# EAGLE design monolithich (EAGLE 6.3)
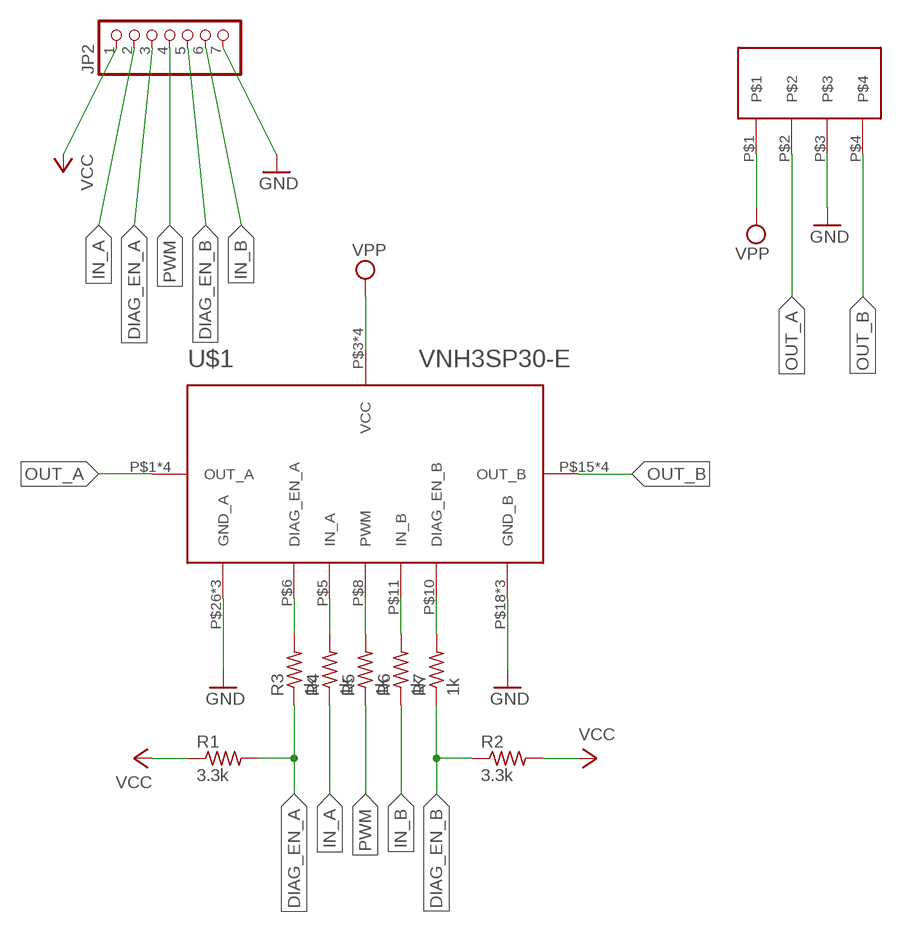
[diagram p0: schematic, sheet 1]

## Parts
JP2  PINHD-1X7  [1X07]
R1  3.3k  R-US_R1206  [R1206]
R2  3.3k  R-US_R1206  [R1206]
R3  1k  R-US_R1206  [R1206]
R4  1k  R-US_R1206  [R1206]
R5  1k  R-US_R1206  [R1206]
R6  1k  R-US_R1206  [R1206]
R7  1k  R-US_R1206  [R1206]
U$1  VNH3SP30-E  [MULTIPOWER-SO-30]
U$2  PINHEAD-5MM-1X4  [5MM-HEADER-4]

## Nets
DIAG_EN_A: JP2.3 R1.2 R3.1
DIAG_EN_B: JP2.5 R2.1 R7.1
GND: JP2.7 U$1.P$18(GND_B) U$1.P$19(GND_B) U$1.P$20(GND_B) U$1.P$26(GND_A) U$1.P$27(GND_A) U$1.P$28(GND_A) U$2.P$3
IN_A: JP2.2 R4.1
IN_B: JP2.6 R6.1
N$1: R3.2 U$1.P$6(DIAG_EN_A)
N$2: R4.2 U$1.P$5(IN_A)
N$3: R5.2 U$1.P$8(PWM)
N$4: R6.2 U$1.P$11(IN_B)
N$5: R7.2 U$1.P$10(DIAG_EN_B)
OUT_A: U$1.P$1(OUT_A) U$1.P$25(OUT_A) U$1.P$30(OUT_A) U$1.T$1(OUT_A) U$2.P$2
OUT_B: U$1.P$15(OUT_B) U$1.P$16(OUT_B) U$1.P$21(OUT_B) U$1.T$2(OUT_B) U$2.P$4
PWM: JP2.4 R5.1
VCC: JP2.1 R1.1 R2.2
VPP: U$1.P$3(VCC) U$1.P$13(VCC) U$1.P$23(VCC) U$1.T$3(VCC) U$2.P$1

## Library data of the parts
JP2 = pinhead:PINHD-1X7: PIN HEADER
R1-R7 = rcl:R-US_: RESISTOR, American symbol
U$1 = controller:VNH3SP30
U$2 = controller:PINHEAD-5MM-1X4

## Board
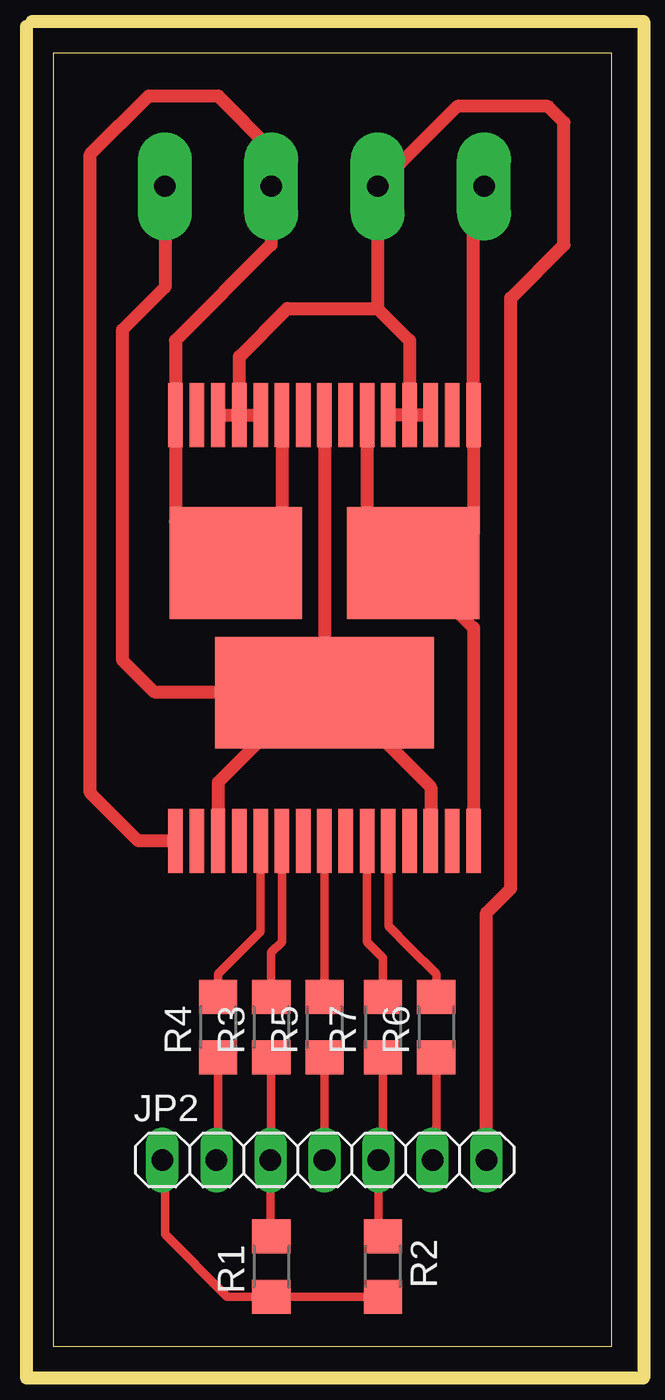
[diagram p1: board, top side]

Size 26.25 x 60.75 mm. Coordinates in mm from the lower left corner, seen from the top.
Outline: 0,0 26.25,0 26.25,60.75 0,60.75 0,0
Copper layers (1*16): Top 0.035mm / dielectric 1.5mm / Bottom 0.035mm
Design rules "default": minimum track width 10mil, minimum drill 24mil, track to track 8mil, track to pad 8mil, pad to pad 8mil, via to via 8mil, smd to smd 8mil, copper to edge 40mil, drill to drill 8mil, minimum pad ring 10mil, minimum via ring 8mil, stop-mask expansion 4mil, vias tented up to drill 0mil, thermal gap 10mil
Milling: 4 lines

### Footprints (pad centres in the part's own frame; a part is rotated, then mirrored left to right if it is on the bottom)
1X07 = drill 1.016 long: 1 -7.62,0; 2 -5.08,0; 3 -2.54,0; 4 0,0; 5 2.54,0; 6 5.08,0; 7 7.62,0
R1206 = smd 1.6 x 1.803: 1 -1.422,0; 2 1.422,0
MULTIPOWER-SO-30 = smd 0.68 x 3: P$1 -7,-10; P$2 -6,-10; P$3 -5,-10; P$4 -4,-10; P$5 -3,-10; P$6 -2,-10; P$7 -1,-10; P$8 0,-10; P$9 1,-10; P$10 2,-10; P$11 3,-10; P$12 4,-10; P$13 5,-10; P$14 6,-10; P$15 7,-10; P$16 7,10; P$17 6,10; P$18 5,10; P$19 4,10; P$20 3,10; P$21 2,10; P$22 1,10; P$23 0,10; P$24 -1,10; P$25 -2,10; P$26 -3,10; P$27 -4,10; P$28 -5,10; P$29 -6,10; P$30 -7,10 | smd 6.23 x 5.25: T$1 -4.165,3.05; T$2 4.165,3.05 | smd 10.3 x 5.25: T$3 0,-3.05
5MM-HEADER-4 = drill 1 pad 2.54 long: P$1 -7.5,0; P$2 -2.5,0; P$3 2.5,0; P$4 7.5,0

### Placement (x,y rotation side)
JP2  12.75,8.75 0 top
R1  10.25,3.75 90 top
R2  15.5,3.75 270 top
R3  10.25,15 90 top
R4  7.75,15 90 top
R5  12.75,15 90 top
R6  18,15 90 top
R7  15.5,15 90 top
U$1  12.75,33.75 0 top
U$2  12.75,54.5 0 top

### Tracks (layer width: path | path; a pad name or v marks a point on that pad's centre or on a via)
DIAG_EN_A
  Top 0.406: R3.1 10.25,8.79 JP2.3 10.21,5.21 R1.2
DIAG_EN_B
  Top 0.406: R7.1 15.5,8.96 JP2.5 15.29,5.38 R2.1
GND
  Top 0.61: U$1.P$28 U$1.P$27 | U$1.P$27 8.75,46.5 11,48.75 15.25,48.75 | 15.25,48.75 16.75,47.25 U$1.P$19 | 15.25,48.75 U$2.P$3 19,58.25 23.25,58.25 24,57.5 24,51.75 21.5,49.25 21.5,21.5 20.37,20.37 JP2.7 | U$1.P$19 U$1.P$18 U$1.P$19 | U$1.P$19 U$1.P$20 | U$1.P$27 U$1.P$26
IN_A
  Top 0.406: R4.1 7.75,9.25 7.75,8.83 JP2.2
IN_B
  Top 0.406: R6.1 18,8.92 JP2.6
N$1
  Top 0.406: U$1.P$6 10.75,19.25 10.75,19 10.25,18.5 R3.2
N$2
  Top 0.406: U$1.P$5 9.75,19.75 9.75,19.5 7.75,17.5 R4.2
N$3
  Top 0.406: U$1.P$8 R5.2
N$4
  Top 0.406: U$1.P$11 15.75,19.75 16.75,18.75 18,17.5 R6.2
N$5
  Top 0.406: U$1.P$10 14.75,19 15.5,18.25 R7.2
OUT_A
  Top 0.61: U$1.P$25 10.75,38.97 U$1.T$1 6.63,38.75 5.75,38.75 U$1.P$30 5.75,47.25 10.25,51.75 U$2.P$2 10.25,56.25 7.75,58.75 7,58.75 4.5,58.75 1.75,56 1.75,26 4,23.75 U$1.P$1
OUT_B
  Top 0.61: U$2.P$4 19.75,54 U$1.P$16 19.75,38.25 18.25,36.75 | U$1.P$21 14.75,38.97 U$1.T$2 16.96,36.75 18.25,36.75 | 18.25,36.75 18.25,35.25 19.75,33.75 U$1.P$15
PWM
  Top 0.406: R5.1 JP2.4
VCC
  Top 0.406: R2.2 R1.1 8.17,2.33 5.25,5.25 5.25,8.63 JP2.1
VPP
  Top 0.61: U$2.P$1 5.25,49.75 3.25,47.75 3.25,32.25 4.75,30.75 12.7,30.75 U$1.T$3 | U$1.P$23 U$1.T$3 | U$1.T$3 11.95,30.7 7.75,26.5 U$1.P$3 | U$1.T$3 13.3,30.7 17.75,26.25 U$1.P$13